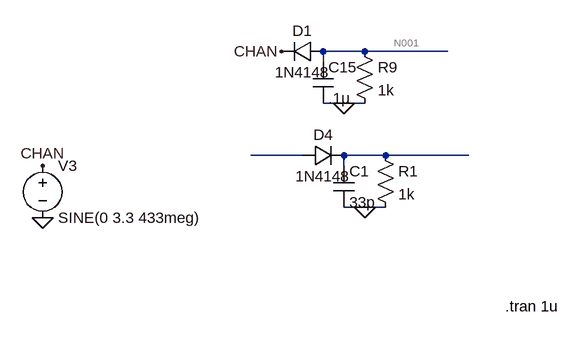
[diagram p0: schematic Draft2.asc]
Draft2.asc, the LTspice schematic file:
Version 4
SHEET 1 880 680
WIRE -1520 -656 -1584 -656
WIRE -1392 -656 -1520 -656
WIRE -1584 -640 -1584 -656
WIRE -1552 -576 -1584 -576
WIRE -1520 -576 -1552 -576
WIRE -1616 -496 -1696 -496
WIRE -1488 -496 -1552 -496
WIRE -1360 -496 -1488 -496
WIRE -1552 -480 -1552 -496
WIRE -1520 -416 -1552 -416
WIRE -1488 -416 -1520 -416
FLAG -2016 -400 0
FLAG -2016 -480 CHAN
FLAG -1648 -656 CHAN
FLAG -1552 -576 0
FLAG -1520 -416 0
SYMBOL res -1536 -672 R0
SYMATTR InstName R9
SYMATTR Value 1k
SYMBOL diode -1616 -480 R270
WINDOW 0 32 32 VTop 2
WINDOW 3 0 32 VBottom 2
SYMATTR InstName D4
SYMATTR Value 1N4148
SYMBOL voltage -2016 -496 R0
WINDOW 123 0 0 Left 2
WINDOW 39 0 0 Left 2
SYMATTR InstName V3
SYMATTR Value SINE(0 3.3 433meg)
SYMBOL cap -1600 -640 R0
SYMATTR InstName C15
SYMATTR Value .1µ
SYMBOL res -1504 -512 R0
SYMATTR InstName R1
SYMATTR Value 1k
SYMBOL diode -1584 -672 R90
WINDOW 0 0 32 VBottom 2
WINDOW 3 32 32 VTop 2
SYMATTR InstName D1
SYMATTR Value 1N4148
SYMBOL cap -1568 -480 R0
SYMATTR InstName C1
SYMATTR Value 33p
TEXT -1304 -264 Left 2 !.tran 1u

The netlist it stands for:
* Draft2.asc
R9 N001 0 1k
D4 N002 N003 1N4148
V3 CHAN 0 SINE(0 3.3 433meg)
C15 N001 0 .1µ
R1 N003 0 1k
D1 N001 CHAN 1N4148
C1 N003 0 33p
.model D D
.lib standard.dio
.tran 1u
.backanno
.end

* Results of the author's LTspice run, read from the files saved beside the schematic
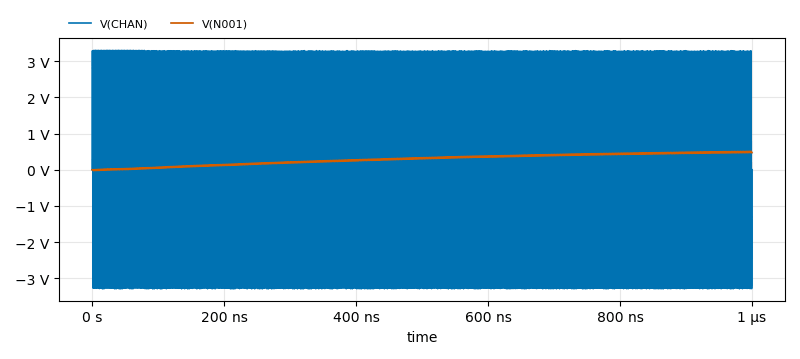
[diagram p1: Transient Analysis of Draft2.asc, plotted from the saved traces]
* Transient Analysis, 1 run:
*   V(CHAN): min -3.292 V, max 3.3 V, average 6.35 mV, rms 2.319 V, last 0 V
*   V(N001): min -26.86 mV, max 508.4 mV, average 289.7 mV, rms 326 mV, last 471.5 mV